# EasyEDA schematic circuit.json
TITLE: 2 LED; REV: 1.0; Date: 2023-09-15; Sheet: 1/1; Company: boolscope
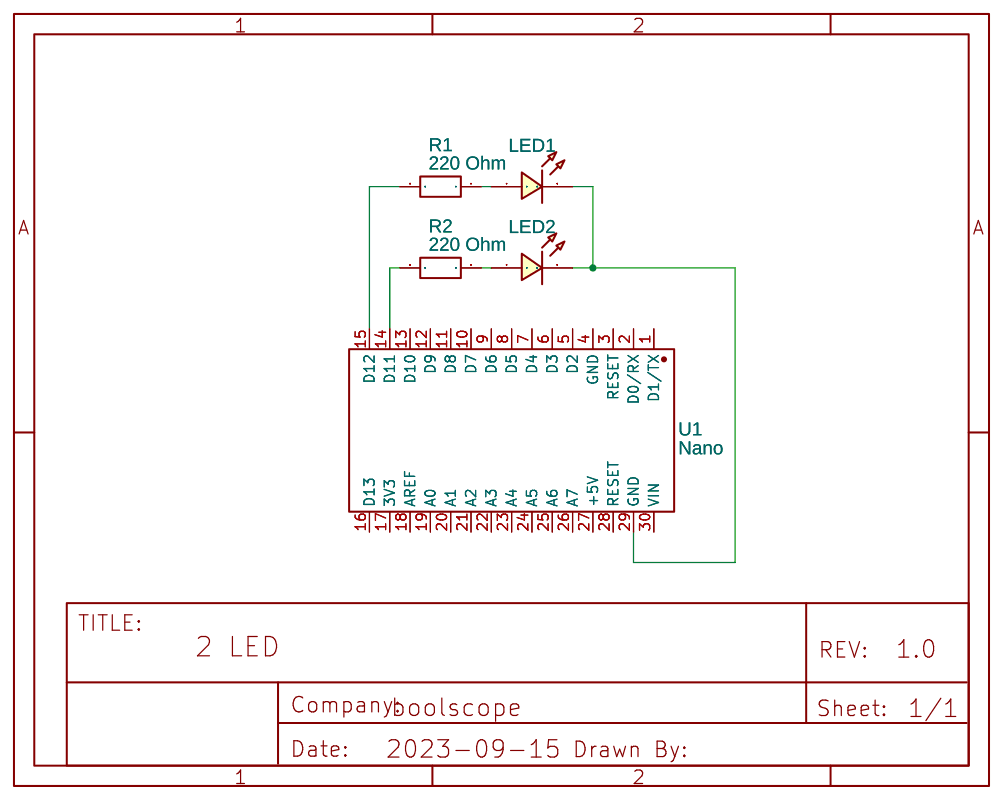
[diagram p0: schematic sheet]

## Parts
LED1  LED-0603_R  [LED0603_RED]
LED2  LED-0603_R  [LED0603_RED]
R1  220 Ohm  [R0603]
R2  220 Ohm  [R0603]
U1  Nano  [COMM-TH_ARDUINO_NANO]

## Library data of the parts
LED1 = LED-0603_R: Manufacturer: EVERLIGHT(台湾亿光); Manufacturer Part: 19-217/R6C-AL1M2VY/3T; Supplier Part: C72044; Supplier: LCSC; Contributor: LCEDA_01; Package Display: No
LED2 = LED-0603_R: Manufacturer: EVERLIGHT(台湾亿光); Manufacturer Part: 19-217/R6C-AL1M2VY/3T; Supplier Part: C72044; Supplier: LCSC; Contributor: LCEDA_01
R1 R2 = R_0603_EU: Contributor: LCEDA_Lib
U1 = ARDUINO_NANO: Contributor: lcsc; Supplier: LCSC; Supplier Part: C9900017879; Manufacturer: null; JLCPCB Part Class: Extended Part; link: https://lcsc.com/eda_search?q=C9900017879&%26type=1&ref=editor

## Nets
Net-(LED1-1): LED1.1 R1.1
Net-(LED1-2): LED1.2 LED2.2 U1.29(GND)
Net-(LED2-1): LED2.1 R2.1
Net-(R1-2): R1.2 U1.15(D12)
Net-(R2-2): R2.2 U1.14(D11)

Not connected (* = marked no-connect by the designer): U1 1(D1/TX) 2(D0/RX) 3(RESET) 4(GND) 5(D2) 6(D3) 7(D4) 8(D5) 9(D6) 10(D7) 11(D8) 12(D9) 13(D10) 16(D13) 17(3V3) 18(AREF) 19(A0) 20(A1) 21(A2) 22(A3) 23(A4) 24(A5) 25(A6) 26(A7) 27(+5V) 28(RESET) 30(VIN)
